# Altium schematic sheet LCD.SchDoc
size A4
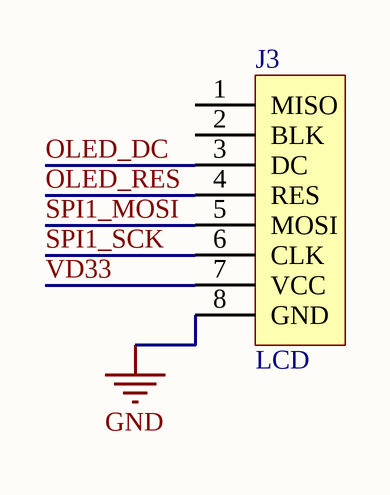
[diagram p0: LCD.SchDoc]

## Parts
J3  LCD  [HDR1X8]

## Nets
GND: J3.8(GND)
OLED_DC: J3.3(DC)
OLED_RES: J3.4(RES)
SPI1_MOSI: J3.5(MOSI)
SPI1_SCK: J3.6(CLK)
VD33: J3.7(VCC)

Not connected (* = marked no-connect by the designer): J3 1(MISO) 2(BLK)

## Library data of the parts
J3 = OLED: 1*8Pin 2.54mm��൥����